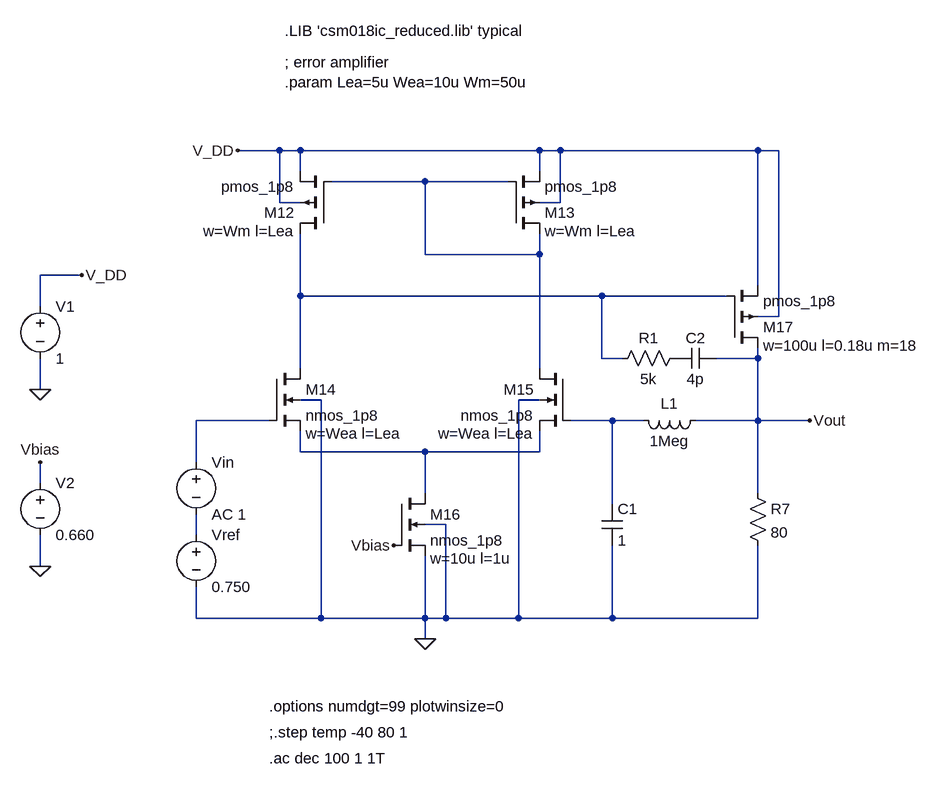
[diagram p0: schematic error_amp.asc]
error_amp.asc, the LTspice schematic file:
Version 4
SHEET 1 2552 792
WIRE 128 -160 64 -160
WIRE 160 -160 128 -160
WIRE 528 -160 160 -160
WIRE 560 -160 528 -160
WIRE 864 -160 560 -160
WIRE 896 -160 864 -160
WIRE 160 -128 160 -160
WIRE 528 -128 528 -160
WIRE 352 -112 208 -112
WIRE 480 -112 352 -112
WIRE 128 -80 128 -160
WIRE 160 -80 128 -80
WIRE 560 -80 560 -160
WIRE 560 -80 528 -80
WIRE 352 0 352 -112
WIRE 528 0 528 -32
WIRE 528 0 352 0
WIRE -176 32 -240 32
WIRE 864 48 864 -160
WIRE 160 64 160 -32
WIRE 624 64 160 64
WIRE 816 64 624 64
WIRE -240 80 -240 32
WIRE 896 96 896 -160
WIRE 896 96 864 96
WIRE 624 160 624 64
WIRE 656 160 624 160
WIRE 864 160 864 144
WIRE 864 160 800 160
WIRE 160 176 160 64
WIRE 528 176 528 0
WIRE -240 208 -240 160
WIRE 192 224 160 224
WIRE 528 224 496 224
WIRE 112 256 0 256
WIRE 640 256 576 256
WIRE 688 256 640 256
WIRE 864 256 864 160
WIRE 864 256 768 256
WIRE 944 256 864 256
WIRE 160 304 160 272
WIRE 352 304 160 304
WIRE 528 304 528 272
WIRE 528 304 352 304
WIRE 0 320 0 256
WIRE -240 352 -240 320
WIRE 352 368 352 304
WIRE 864 368 864 256
WIRE 640 384 640 256
WIRE 384 416 352 416
WIRE 0 432 0 400
WIRE -240 480 -240 432
WIRE 0 560 0 512
WIRE 192 560 192 224
WIRE 192 560 0 560
WIRE 352 560 352 464
WIRE 352 560 192 560
WIRE 384 560 384 416
WIRE 384 560 352 560
WIRE 496 560 496 224
WIRE 496 560 384 560
WIRE 640 560 640 448
WIRE 640 560 496 560
WIRE 864 560 864 448
WIRE 864 560 640 560
WIRE 352 592 352 560
FLAG -240 208 0
FLAG -176 32 V_DD
FLAG 944 256 Vout
FLAG 304 448 Vbias
FLAG 352 592 0
FLAG 64 -160 V_DD
FLAG -240 480 0
FLAG -240 320 Vbias
DATAFLAG 432 304 ""
DATAFLAG 384 64 ""
DATAFLAG 64 256 ""
DATAFLAG 928 256 ""
DATAFLAG 528 96 ""
SYMBOL voltage -240 64 R0
WINDOW 123 0 0 Left 0
WINDOW 39 0 0 Left 0
SYMATTR InstName V1
SYMATTR Value 1
SYMBOL pmos4 208 -32 R180
WINDOW 123 56 4 Left 2
SYMATTR Value2 w=Wm l=Lea
SYMATTR InstName M12
SYMATTR Value pmos_1p8
SYMBOL pmos4 480 -32 M180
WINDOW 123 56 4 Left 2
SYMATTR Value2 w=Wm l=Lea
SYMATTR InstName M13
SYMATTR Value pmos_1p8
SYMBOL nmos4 112 176 R0
WINDOW 123 56 100 Left 2
SYMATTR Value2 w=Wea l=Lea
SYMATTR InstName M14
SYMATTR Value nmos_1p8
SYMBOL nmos4 576 176 M0
WINDOW 123 56 100 Left 2
SYMATTR Value2 w=Wea l=Lea
SYMATTR InstName M15
SYMATTR Value nmos_1p8
SYMBOL nmos4 304 368 R0
WINDOW 123 56 100 Left 2
SYMATTR Value2 w=10u l=1u
SYMATTR InstName M16
SYMATTR Value nmos_1p8
SYMBOL pmos4 816 144 M180
WINDOW 123 56 4 Left 2
SYMATTR Value2 w=100u l=0.18u m=18
SYMATTR InstName M17
SYMATTR Value pmos_1p8
SYMBOL res 848 352 R0
SYMATTR InstName R7
SYMATTR Value 80
SYMBOL voltage 0 304 R0
SYMATTR InstName Vin
SYMATTR Value AC 1
SYMBOL ind 784 240 R90
WINDOW 0 5 56 VBottom 2
WINDOW 3 32 56 VTop 2
SYMATTR InstName L1
SYMATTR Value 1Meg
SYMBOL cap 624 384 R0
SYMATTR InstName C1
SYMATTR Value 1
SYMBOL voltage -240 336 R0
SYMATTR InstName V2
SYMATTR Value 0.660
SYMBOL voltage 0 416 R0
WINDOW 123 0 0 Left 0
WINDOW 39 0 0 Left 0
SYMATTR InstName Vref
SYMATTR Value 0.750
SYMBOL cap 800 144 R90
WINDOW 0 0 32 VBottom 2
WINDOW 3 32 32 VTop 2
SYMATTR InstName C2
SYMATTR Value 4p
SYMBOL res 752 144 R90
WINDOW 0 0 56 VBottom 2
WINDOW 3 32 56 VTop 2
SYMATTR InstName R1
SYMATTR Value 5k
TEXT 136 -344 Left 2 !.LIB 'csm018ic_reduced.lib' typical
TEXT 112 696 Left 2 !.options numdgt=99 plotwinsize=0
TEXT 112 776 Left 2 !.ac dec 100 1 1T
TEXT 112 736 Left 2 !;.step temp -40 80 1
TEXT 136 -296 Left 2 !; error amplifier\n.param Lea=5u Wea=10u Wm=50u

The netlist it stands for:
* error_amp.asc
V1 V_DD 0 1
M12 N002 N001 V_DD V_DD pmos_1p8 w=Wm l=Lea
M13 N001 N001 V_DD V_DD pmos_1p8 w=Wm l=Lea
M14 N002 N003 N005 0 nmos_1p8 w=Wea l=Lea
M15 N001 N004 N005 0 nmos_1p8 w=Wea l=Lea
M16 N005 Vbias 0 0 nmos_1p8 w=10u l=1u
M17 Vout N002 V_DD V_DD pmos_1p8 w=100u l=0.18u m=18
R7 Vout 0 80
Vin N003 N006 AC 1
L1 Vout N004 1Meg
C1 N004 0 1
V2 Vbias 0 0.660
Vref N006 0 0.750
C2 Vout P001 4p
R1 P001 N002 5k
.model NMOS NMOS
.model PMOS PMOS
.lib standard.mos
.LIB 'csm018ic_reduced.lib' typical
.options numdgt=99 plotwinsize=0
.ac dec 100 1 1T
;.step temp -40 80 1
; error amplifier
.param Lea=5u Wea=10u Wm=50u
.backanno
.end